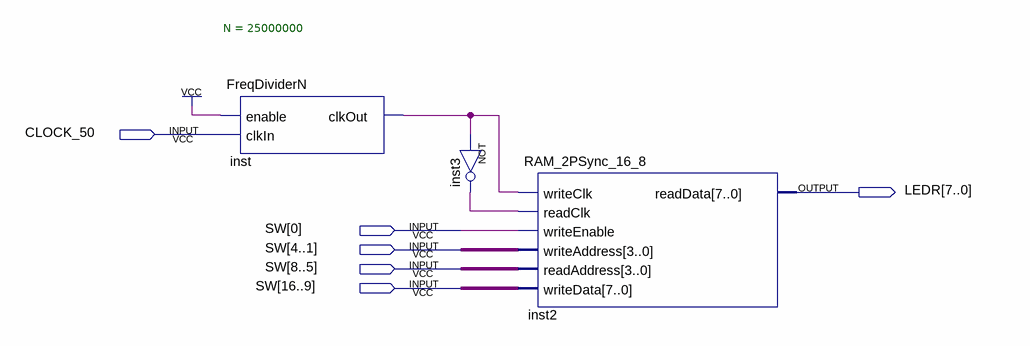
[diagram p0: schematic sheet]
// Quartus schematic RAM_2PSync_Demo.bdf as structural Verilog: 3 symbols, 6 pins
module RAM_2PSync_Demo (
  input  CLOCK_50,
  input  [16:0] SW,
  output [7:0] LEDR
);

  wire inst3_out, inst_clkout;

  FreqDividerN #(.N(25000000)) inst (.enable(1'b1), .clkIn(CLOCK_50), .clkOut(inst_clkout));
  not inst3 (inst3_out, inst_clkout);
  RAM_2PSync_16_8 inst2 (
    .writeClk(inst_clkout), .readClk(inst3_out), .writeEnable(SW[0]), .writeAddress(SW[4:1]),
    .readAddress(SW[8:5]), .writeData(SW[16:9]), .readData(LEDR));
endmodule
